# Altium schematic sheet MR26_GSS_4.SchDoc
size 325 x 297 mm; Origin: Eagle; OriginPath: C:\Users\David Nguyen\Downloads\eagle\eagle\MR26_GSS.sch; OriginSheet: 5; OriginDescription: 06 FPGA configuration, JTAG & clock
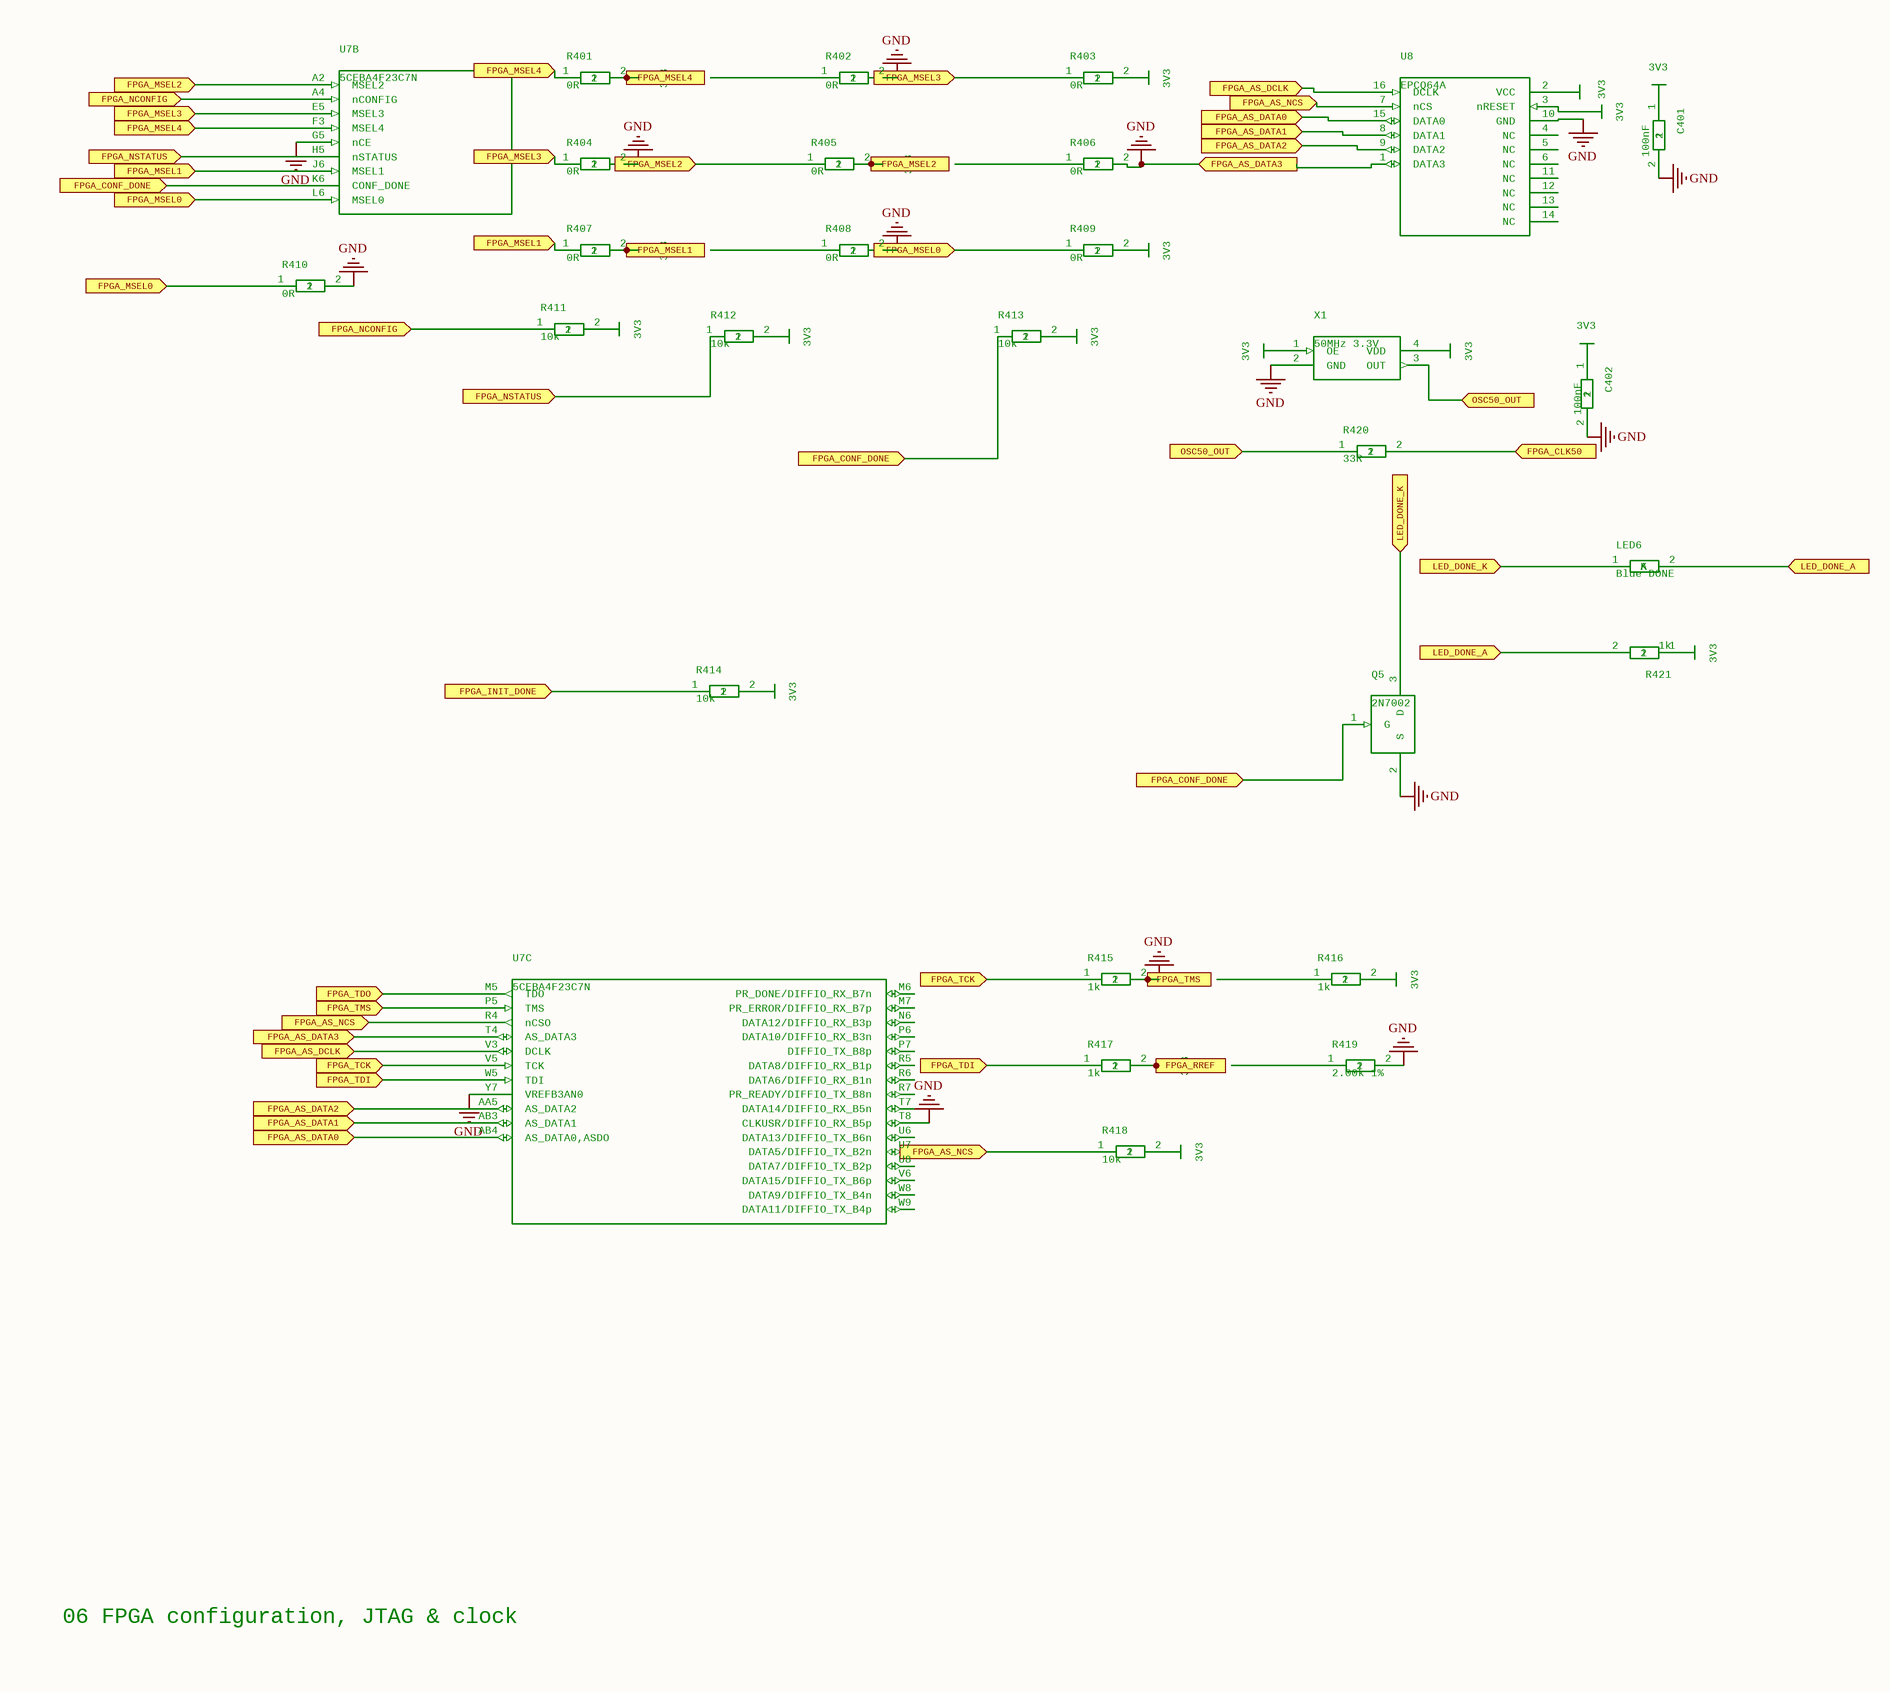
[diagram p0: MR26_GSS_4.SchDoc]

## Parts
C401  100nF  [C_0402]
C402  100nF  [C_0402]
LED6  Blue DONE  [LED_0603]
PWR0410  3V3
PWR0412  3V3
PWR0414  3V3
PWR0416  3V3
PWR0418  3V3
PWR0420  3V3
PWR0421  3V3
PWR0422  3V3
PWR0423  3V3
PWR0427  3V3
PWR0428  3V3
PWR0429  3V3
PWR0431  3V3
PWR0432  3V3
PWR0434  3V3
PWR0436  3V3
PWR0438  3V3
PWR0439  3V3
PWR0442  3V3
Q5  2N7002  [SOT-23]
R401  0R  [R_0402]
R402  0R  [R_0402]
R403  0R  [R_0402]
R404  0R  [R_0402]
R405  0R  [R_0402]
R406  0R  [R_0402]
R407  0R  [R_0402]
R408  0R  [R_0402]
R409  0R  [R_0402]
R410  0R  [R_0402]
R411  10k  [R_0402]
R412  10k  [R_0402]
R413  10k  [R_0402]
R414  10k  [R_0402]
R415  1k  [R_0402]
R416  1k  [R_0402]
R417  1k  [R_0402]
R418  10k  [R_0402]
R419  2.00k 1%  [R_0402]
R420  33R  [R_0402]
R421  1k  [R_0402]
U7  5CEBA4F23C7N  [FBGA-484_23x23_1.0mm]  (parts B,C of 12)
U8  EPCQ64A  [SOIC-16W_7.5x10.3]
X1  50MHz 3.3V  [OSC_2.5x2.0]

## Ports
FPGA_AS_DATA0 (in), FPGA_AS_DATA1 (in), FPGA_AS_DATA2 (in), FPGA_AS_DATA3 (in), FPGA_AS_DCLK (in), FPGA_AS_NCS (in), FPGA_CLK50 (in), FPGA_CONF_DONE (in), FPGA_INIT_DONE (in), FPGA_MSEL0 (in), FPGA_MSEL1 (in), FPGA_MSEL2 (in), FPGA_MSEL3 (in), FPGA_MSEL4 (in), FPGA_NCONFIG (in), FPGA_NSTATUS (in), FPGA_RREF (in), FPGA_TCK (in), FPGA_TDI (in), FPGA_TDO (in), FPGA_TMS (in), LED_DONE_A (in), LED_DONE_K (in), OSC50_OUT (in)

## Nets
GND: C401.2 C402.2 Q5.2(S) R402.2 R404.2 R406.2 R408.2 R410.2 R415.2 R419.2 U7.G5(nCE) U7.P5(TMS) U7.T4(AS_DATA3) U7.T8(CLKUSR/DIFFIO_RX_B5p) U7.Y7(VREFB3AN0) U8.1(DATA3) U8.10(GND) X1.2(GND) ; port FPGA_TMS, port FPGA_AS_DATA3
FPGA_AS_DATA0: U7.AB4(AS_DATA0,ASDO) U8.15(DATA0) ; port FPGA_AS_DATA0
FPGA_AS_DATA1: U7.AB3(AS_DATA1) U8.8(DATA1) ; port FPGA_AS_DATA1
FPGA_AS_DATA2: U7.AA5(AS_DATA2) U8.9(DATA2) ; port FPGA_AS_DATA2
FPGA_AS_DCLK: U7.V3(DCLK) U8.16(DCLK) ; port FPGA_AS_DCLK
FPGA_AS_NCS: R418.1 U7.R4(nCSO) U8.7(nCS) ; port FPGA_AS_NCS
FPGA_CLK50: R420.2 ; port FPGA_CLK50
FPGA_CONF_DONE: Q5.1(G) R413.1 U7.K6(CONF_DONE) ; port FPGA_CONF_DONE
FPGA_INIT_DONE: R414.1 ; port FPGA_INIT_DONE
FPGA_MSEL0: R409.1 R410.1 U7.L6(MSEL0) ; port FPGA_MSEL0
FPGA_MSEL1: PWR0416.?1(3V3) R407.1 R407.2 U7.J6(MSEL1) ; port FPGA_MSEL1
FPGA_MSEL2: PWR0414.?1(3V3) R405.1 R405.2 U7.A2(MSEL2) ; port FPGA_MSEL2
FPGA_MSEL3: R403.1 R404.1 U7.E5(MSEL3) ; port FPGA_MSEL3
FPGA_MSEL4: PWR0410.?1(3V3) R401.1 R401.2 U7.F3(MSEL4) ; port FPGA_MSEL4
FPGA_NCONFIG: R411.1 U7.A4(nCONFIG) ; port FPGA_NCONFIG
FPGA_NSTATUS: R412.1 U7.H5(nSTATUS) ; port FPGA_NSTATUS
FPGA_RREF: PWR0428.?1(3V3) R417.2 ; port FPGA_RREF
FPGA_TCK: R415.1 U7.V5(TCK) ; port FPGA_TCK
FPGA_TDI: R417.1 U7.W5(TDI) ; port FPGA_TDI
FPGA_TDO: U7.M5(TDO) ; port FPGA_TDO
LED_DONE_A: LED6.2(A) R421.2 ; port LED_DONE_A
LED_DONE_K: LED6.1(K) Q5.3(D) ; port LED_DONE_K
OSC50_OUT: R420.1 X1.3(OUT) ; port OSC50_OUT
NetC401_1: C401.1 PWR0434.?1(3V3)
NetC402_1: C402.1 PWR0439.?1(3V3)
NetPWR0412_?1: PWR0412.?1(3V3) R403.2
NetPWR0418_?1: PWR0418.?1(3V3) R409.2
NetPWR0420_?1: PWR0420.?1(3V3) R411.2
NetPWR0421_?1: PWR0421.?1(3V3) R412.2
NetPWR0422_?1: PWR0422.?1(3V3) R413.2
NetPWR0423_?1: PWR0423.?1(3V3) R414.2
NetPWR0427_?1: PWR0427.?1(3V3) R416.2
NetPWR0429_?1: PWR0429.?1(3V3) R418.2
NetPWR0431_?1: PWR0431.?1(3V3) U8.2(VCC)
NetPWR0432_?1: PWR0432.?1(3V3) U8.3(nRESET)
NetPWR0436_?1: PWR0436.?1(3V3) X1.1(OE)
NetPWR0438_?1: PWR0438.?1(3V3) X1.4(VDD)
NetPWR0442_?1: PWR0442.?1(3V3) R421.1

Not connected (* = marked no-connect by the designer): R402 1; R406 1; R408 1; R416 1; R419 1; U7 M6(PR_DONE/DIFFIO_RX_B7n) M7(PR_ERROR/DIFFIO_RX_B7p) N6(DATA12/DIFFIO_RX_B3p) P6(DATA10/DIFFIO_RX_B3n) P7(DIFFIO_TX_B8p) R5(DATA8/DIFFIO_RX_B1p) R6(DATA6/DIFFIO_RX_B1n) R7(PR_READY/DIFFIO_TX_B8n) T7(DATA14/DIFFIO_RX_B5n) U6(DATA13/DIFFIO_TX_B6n) U7(DATA5/DIFFIO_TX_B2n) U8(DATA7/DIFFIO_TX_B2p) V6(DATA15/DIFFIO_TX_B6p) W8(DATA9/DIFFIO_TX_B4n) W9(DATA11/DIFFIO_TX_B4p); U8 4(NC) 5(NC) 6(NC) 11(NC) 12(NC) 13(NC) 14(NC)

## Notes on the sheet
- 06 FPGA configuration, JTAG & clock

## Library data of the parts
C401 C402 = CAPC_0402: MPN: CAP 100nF 0402; GateName_1: G$1; SymbolName_1: CAP; DeviceName: C_0402; LibraryName: MR26; DeviceSetName: CAP
LED6 = LEDLED_0603: MPN: Wurth 150060BS75000; GateName_1: G$1; SymbolName_1: LED; DeviceName: LED_0603; LibraryName: MR26; DeviceSetName: LED
PWR0410 PWR0412 PWR0414 PWR0416 PWR0418 PWR0420 PWR0421 PWR0422 PWR0423 PWR0427 PWR0428 PWR0429 PWR0431 PWR0432 PWR0434 PWR0436 PWR0438 PWR0439 PWR0442 = PWR_3V3: GateName_1: G$1; SymbolName_1: PWR_3V3; LibraryName: MR26; DeviceSetName: PWR_3V3
Q5 = NMOS_SOT23SOT-23: MPN: 2N7002,215; GateName_1: G$1; SymbolName_1: NMOS_SOT23; DeviceName: SOT-23; LibraryName: MR26; DeviceSetName: NMOS_SOT23
R401-R410 = RESR_0402: MPN: RES 0R 0402; GateName_1: G$1; SymbolName_1: RES; DeviceName: R_0402; LibraryName: MR26; DeviceSetName: RES
R411-R414 R418 = RESR_0402: MPN: RES 10k 0402; GateName_1: G$1; SymbolName_1: RES; DeviceName: R_0402; LibraryName: MR26; DeviceSetName: RES
R415-R417 R421 = RESR_0402: MPN: RES 1k 0402; GateName_1: G$1; SymbolName_1: RES; DeviceName: R_0402; LibraryName: MR26; DeviceSetName: RES
R419 = RESR_0402: MPN: RES 2.00k 1% 0402; GateName_1: G$1; SymbolName_1: RES; DeviceName: R_0402; LibraryName: MR26; DeviceSetName: RES
R420 = RESR_0402: MPN: RES 33R 0402; GateName_1: G$1; SymbolName_1: RES; DeviceName: R_0402; LibraryName: MR26; DeviceSetName: RES
U7 = 5CEBA4F23C7NFBGA-484_23x23_1.0mm: GateName_1: A; SymbolName_1: 5CEBA4F23C7N_A; GateName_2: B; SymbolName_2: 5CEBA4F23C7N_B; GateName_3: C; SymbolName_3: 5CEBA4F23C7N_C; GateName_4: D; SymbolName_4: 5CEBA4F23C7N_D; GateName_5: E; SymbolName_5: 5CEBA4F23C7N_E; GateName_6: F; SymbolName_6: 5CEBA4F23C7N_F; GateName_7: G; SymbolName_7: 5CEBA4F23C7N_G; GateName_8: H; SymbolName_8: 5CEBA4F23C7N_H; GateName_9: I; SymbolName_9: 5CEBA4F23C7N_I; GateName_10: J; SymbolName_10: 5CEBA4F23C7N_J; GateName_11: K; SymbolName_11: 5CEBA4F23C7N_K; GateName_12: L; SymbolName_12: 5CEBA4F23C7N_L; DeviceName: FBGA-484_23x23_1.0mm; LibraryName: MR26; DeviceSetName: 5CEBA4F23C7N; MPN: 5CEBA4F23C7N
U8 = EPCQ64A_SOIC16SOIC-16W_7.5x10.3: MPN: EPCQ64ASI16N; GateName_1: G$1; SymbolName_1: EPCQ64A_SOIC16; DeviceName: SOIC-16W_7.5x10.3; LibraryName: MR26; DeviceSetName: EPCQ64A_SOIC16
X1 = OSC_4PINOSC_2.5x2.0: MPN: SIT1602BI-23-33E-50.000000; GateName_1: G$1; SymbolName_1: OSC_4PIN; DeviceName: OSC_2.5x2.0; LibraryName: MR26; DeviceSetName: OSC_4PIN